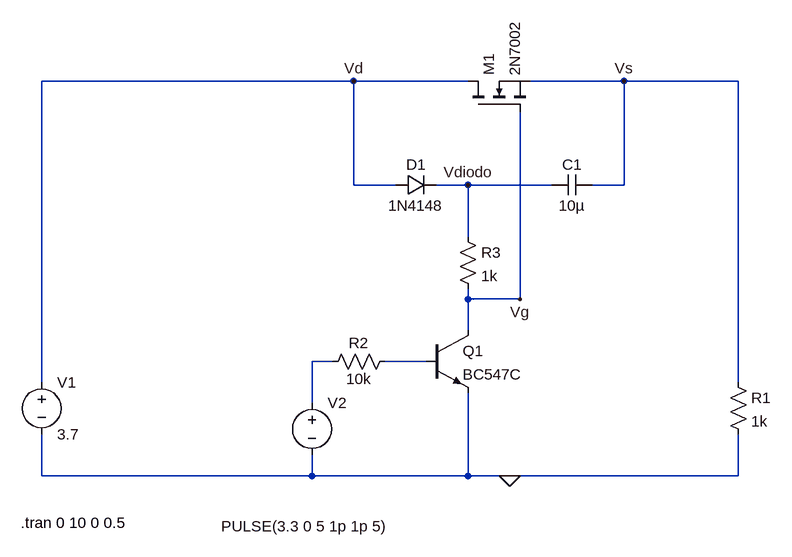
[diagram p0: schematic llave canal N.asc]
llave canal N.asc, the LTspice schematic file:
Version 4
SHEET 1 880 896
WIRE 0 112 -480 112
WIRE 176 112 0 112
WIRE 416 112 272 112
WIRE 592 112 416 112
WIRE 0 272 0 112
WIRE 64 272 0 272
WIRE 176 272 128 272
WIRE 304 272 176 272
WIRE 416 272 416 112
WIRE 416 272 368 272
WIRE 176 352 176 272
WIRE 176 448 176 432
WIRE 256 448 256 160
WIRE 256 448 176 448
WIRE 176 496 176 448
WIRE -32 544 -64 544
WIRE 112 544 48 544
WIRE -480 576 -480 112
WIRE 592 576 592 112
WIRE -64 608 -64 544
WIRE -480 720 -480 656
WIRE -64 720 -64 688
WIRE -64 720 -480 720
WIRE 176 720 176 592
WIRE 176 720 -64 720
WIRE 240 720 176 720
WIRE 592 720 592 656
WIRE 592 720 240 720
FLAG 240 720 0
FLAG 256 448 Vg
FLAG 416 112 Vs
FLAG 0 112 Vd
FLAG 176 272 Vdiodo
SYMBOL nmos 176 160 R270
SYMATTR InstName M1
SYMATTR Value 2N7002
SYMBOL voltage -480 560 R0
WINDOW 123 0 0 Left 0
WINDOW 39 0 0 Left 0
SYMATTR InstName V1
SYMATTR Value 3.7
SYMBOL res 576 560 R0
SYMATTR InstName R1
SYMATTR Value 1k
SYMBOL voltage -64 592 R0
WINDOW 3 -140 206 Left 2
WINDOW 123 0 0 Left 0
WINDOW 39 0 0 Left 0
SYMATTR InstName V2
SYMATTR Value PULSE(3.3 0 5 1p 1p 5)
SYMBOL npn 112 496 R0
SYMATTR InstName Q1
SYMATTR Value BC547C
SYMBOL res 64 528 R90
WINDOW 0 3 56 VBottom 2
WINDOW 3 27 56 VTop 2
SYMATTR InstName R2
SYMATTR Value 10k
SYMBOL diode 64 288 R270
WINDOW 0 32 32 VTop 2
WINDOW 3 0 32 VBottom 2
SYMATTR InstName D1
SYMATTR Value 1N4148
SYMBOL cap 368 256 R90
WINDOW 0 0 32 VBottom 2
WINDOW 3 32 32 VTop 2
SYMATTR InstName C1
SYMATTR Value 10µ
SYMBOL res 160 336 R0
SYMATTR InstName R3
SYMATTR Value 1k
TEXT -512 792 Left 2 !.tran 0 10 0 0.5

The netlist it stands for:
* llave canal N.asc
M1 Vd Vg Vs Vs 2N7002
V1 Vd 0 3.7
R1 Vs 0 1k
V2 N001 0 PULSE(3.3 0 5 1p 1p 5)
Q1 Vg N002 0 0 BC547C
R2 N002 N001 10k
D1 Vd Vdiodo 1N4148
C1 Vs Vdiodo 10µ
R3 Vdiodo Vg 1k
.model D D
.lib standard.dio
.model NPN NPN
.model PNP PNP
.lib standard.bjt
.model NMOS NMOS
.model PMOS PMOS
.lib standard.mos
.tran 0 10 0 0.5
.backanno
.end